# EAGLE design calculator5 (EAGLE 9.6.2)

## Sheet 1 of 2
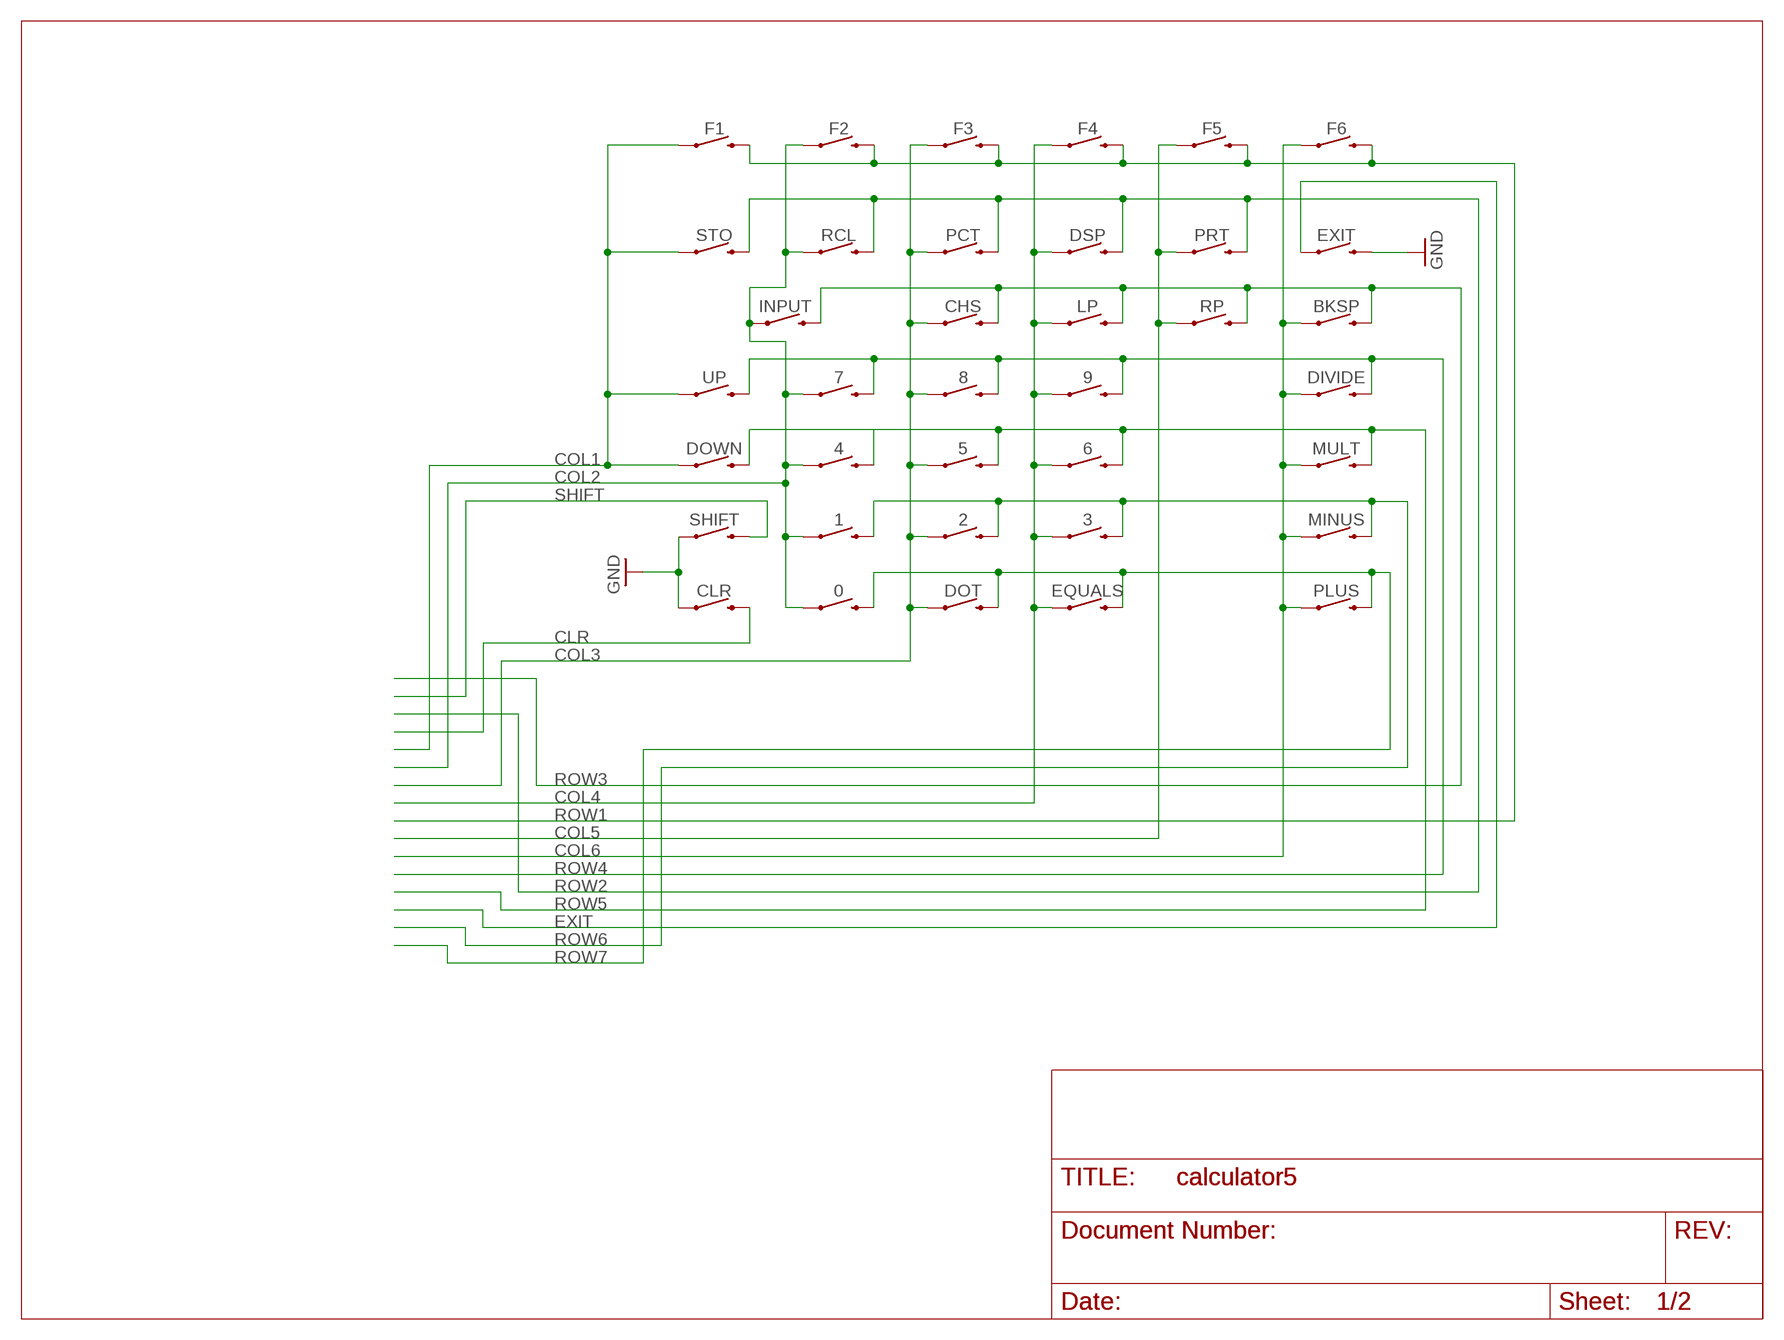
[diagram p0: schematic, sheet 1]

### Parts
0  BUTTON  [BUTTON]
1  BUTTON  [BUTTON]
2  BUTTON  [BUTTON]
3  BUTTON  [BUTTON]
4  BUTTON  [BUTTON]
5  BUTTON  [BUTTON]
6  BUTTON  [BUTTON]
7  BUTTON  [BUTTON]
8  BUTTON  [BUTTON]
9  BUTTON  [BUTTON]
BKSP  BUTTON  [BUTTON]
CHS  BUTTON  [BUTTON]
CLR  BUTTON  [BUTTON]
DIVIDE  BUTTON  [BUTTON]
DOT  BUTTON  [BUTTON]
DOWN  BUTTON  [BUTTON]
DSP  BUTTON  [BUTTON]
EQUALS  BUTTON  [BUTTON]
EXIT  BUTTON  [BUTTON]
F1  BUTTON  [BUTTON]
F2  BUTTON  [BUTTON]
F3  BUTTON  [BUTTON]
F4  BUTTON  [BUTTON]
F5  BUTTON  [BUTTON]
F6  BUTTON  [BUTTON]
INPUT  BUTTON  [BUTTON]
LP  BUTTON  [BUTTON]
MINUS  BUTTON  [BUTTON]
MULT  BUTTON  [BUTTON]
PCT  BUTTON  [BUTTON]
PLUS  BUTTON  [BUTTON]
PRT  BUTTON  [BUTTON]
RCL  BUTTON  [BUTTON]
RP  BUTTON  [BUTTON]
SHIFT  BUTTON  [BUTTON]
STO  BUTTON  [BUTTON]
UP  BUTTON  [BUTTON]

### Nets
CLR: CLR.3 ; also sheet 2
COL1: DOWN.1 F1.1 STO.1 UP.1 ; also sheet 2
COL2: 0.1 1.1 4.1 7.1 F2.1 INPUT.1 RCL.1 ; also sheet 2
COL3: 2.1 5.1 8.1 CHS.1 DOT.1 F3.1 PCT.1 ; also sheet 2
COL4: 3.1 6.1 9.1 DSP.1 EQUALS.1 F4.1 LP.1 ; also sheet 2
COL5: F5.1 PRT.1 RP.1 ; also sheet 2
COL6: BKSP.1 DIVIDE.1 F6.1 MINUS.1 MULT.1 PLUS.1 ; also sheet 2
EXIT: EXIT.1 ; also sheet 2
GND: CLR.1 EXIT.3 SHIFT.1 ; also sheet 2
ROW1: F1.3 F2.3 F3.3 F4.3 F5.3 F6.3 ; also sheet 2
ROW2: DSP.3 PCT.3 PRT.3 RCL.3 STO.3 ; also sheet 2
ROW3: BKSP.3 CHS.3 INPUT.3 LP.3 RP.3 ; also sheet 2
ROW4: 7.3 8.3 9.3 DIVIDE.3 UP.3 ; also sheet 2
ROW5: 4.3 5.3 6.3 DOWN.3 MULT.3 ; also sheet 2
ROW6: 1.3 2.3 3.3 MINUS.3 ; also sheet 2
ROW7: 0.3 DOT.3 EQUALS.3 PLUS.3 ; also sheet 2
SHIFT: SHIFT.3 ; also sheet 2

## Sheet 2 of 2
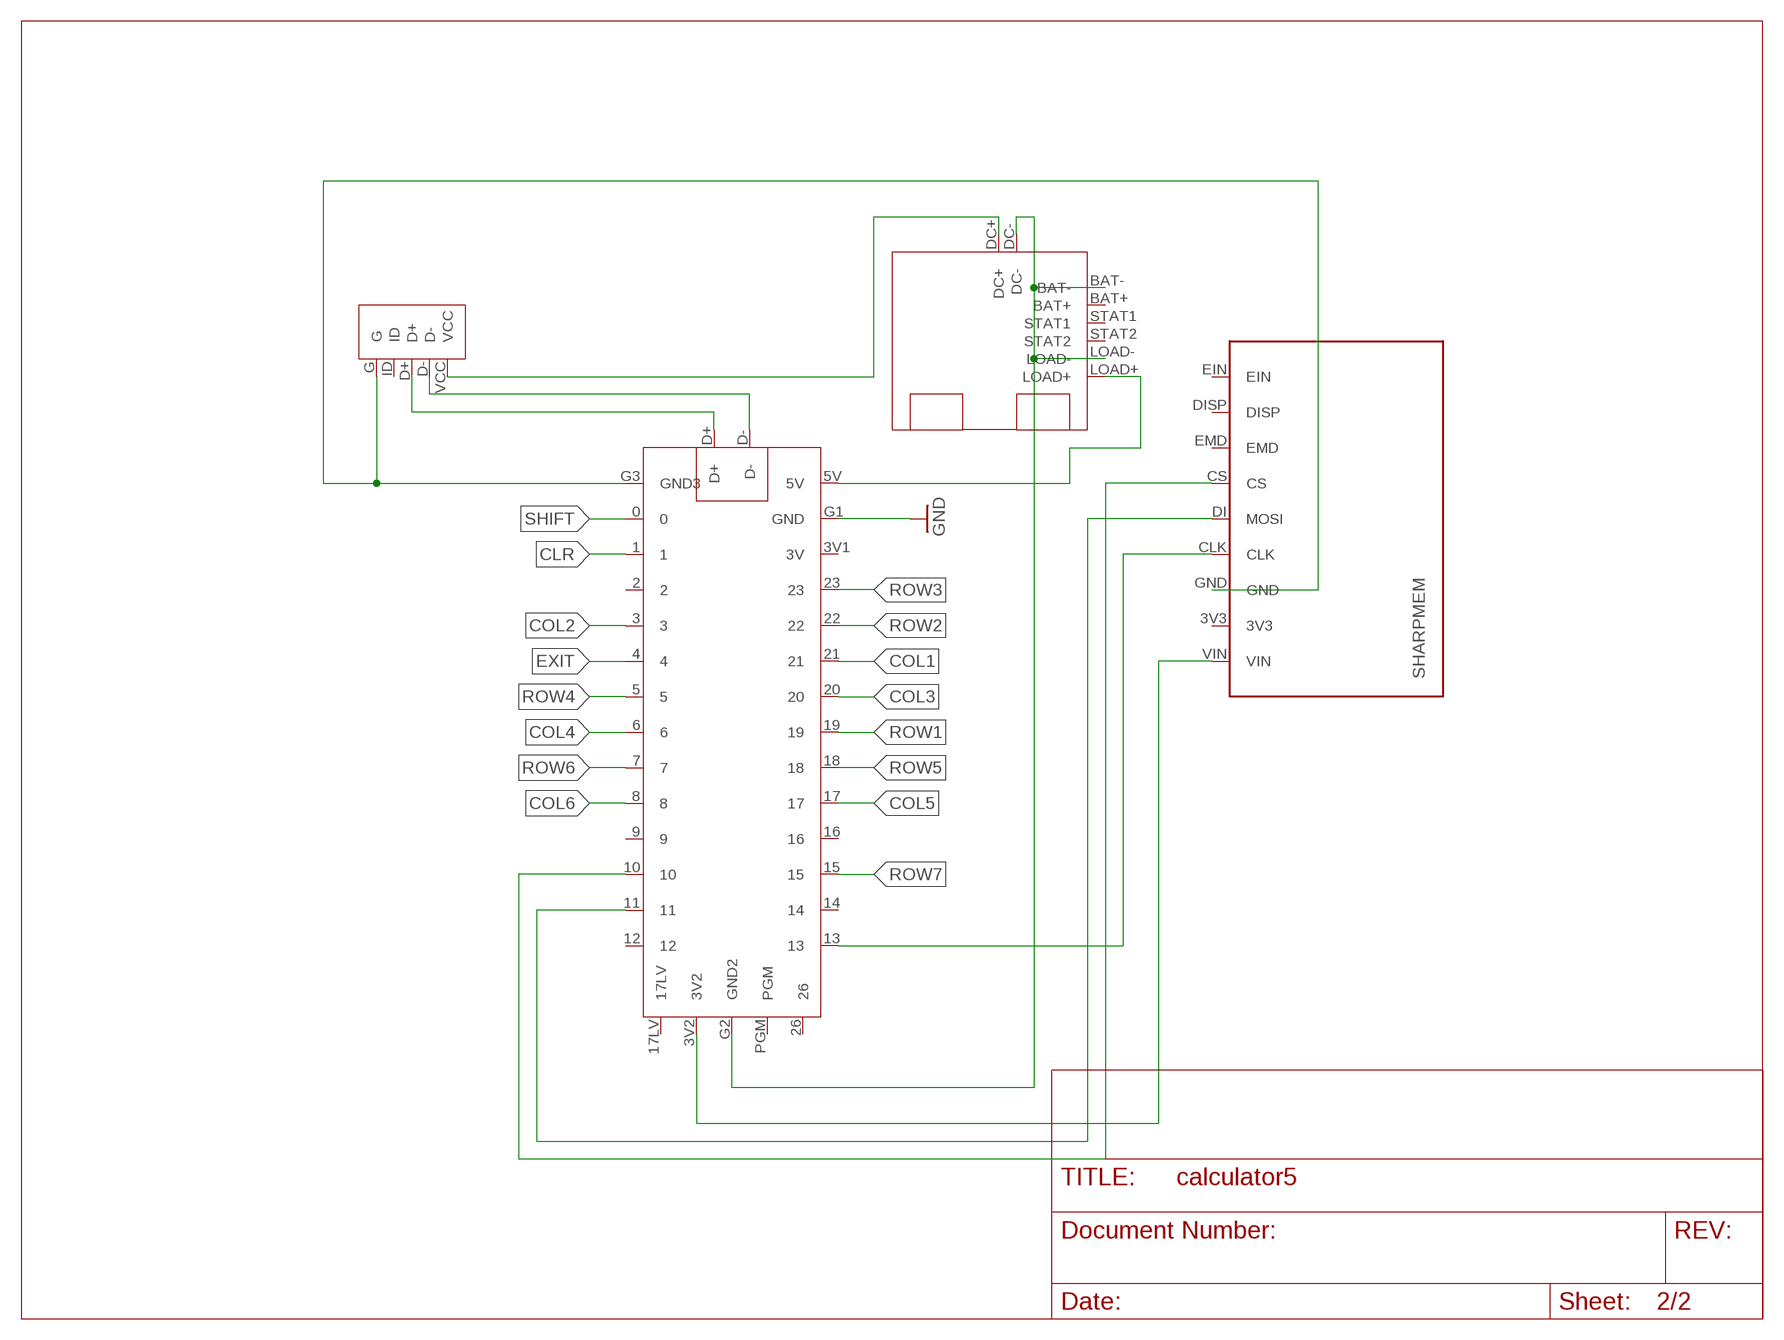
[diagram p1: schematic, sheet 2]

### Parts
SHARPMEM  SHARPMEM  [SHARPMEM]
U$1  TEENSY_LC  [TEENSY_LC]
U$2  USB  [USB]
U$3  LIPO_CHARGER  [LIPO_CHARGER]

### Nets
3V3: SHARPMEM.VIN U$1.3V2
CLR: U$1.1 ; also sheet 1
COL1: U$1.21 ; also sheet 1
COL2: U$1.3 ; also sheet 1
COL3: U$1.20 ; also sheet 1
COL4: U$1.6 ; also sheet 1
COL5: U$1.17 ; also sheet 1
COL6: U$1.8 ; also sheet 1
CS: SHARPMEM.CS U$1.10
D-: U$1.D- U$2.D-
EXIT: U$1.4 ; also sheet 1
G2: U$1.G2(GND2) U$3.BAT- U$3.DC- U$3.LOAD-
G3: SHARPMEM.GND U$1.G3(GND3) U$2.G
GND: U$1.G1(GND) ; also sheet 1
LOAD+: U$1.5V U$3.LOAD+
MOSI: SHARPMEM.DI(MOSI) U$1.11
N$6: U$1.D+ U$2.D+
ROW1: U$1.19 ; also sheet 1
ROW2: U$1.22 ; also sheet 1
ROW3: U$1.23 ; also sheet 1
ROW4: U$1.5 ; also sheet 1
ROW5: U$1.18 ; also sheet 1
ROW6: U$1.7 ; also sheet 1
ROW7: U$1.15 ; also sheet 1
SCK: SHARPMEM.CLK U$1.13
SHIFT: U$1.0 ; also sheet 1
VCC: U$2.VCC U$3.DC+
Unconnected: SHARPMEM.3V3 SHARPMEM.DISP SHARPMEM.EIN SHARPMEM.EMD U$1.2 U$1.3V1(3V) U$1.9 U$1.12 U$1.14 U$1.16 U$1.17LV U$1.26 U$1.PGM U$2.ID U$3.BAT+ U$3.STAT1 U$3.STAT2

## Library data of the parts
0 1-9 BKSP CHS CLR DIVIDE DOT DOWN DSP EQUALS EXIT F1-F6 INPUT LP MINUS MULT PCT PLUS PRT RCL RP SHIFT STO UP = aaa_pw:BUTTON
SHARPMEM = aaa_pw:SHARPMEM
U$1 = aaa_pw:TEENSY_LC
U$2 = aaa_pw:USB
U$3 = aaa_pw:LIPO_CHARGER

## Board
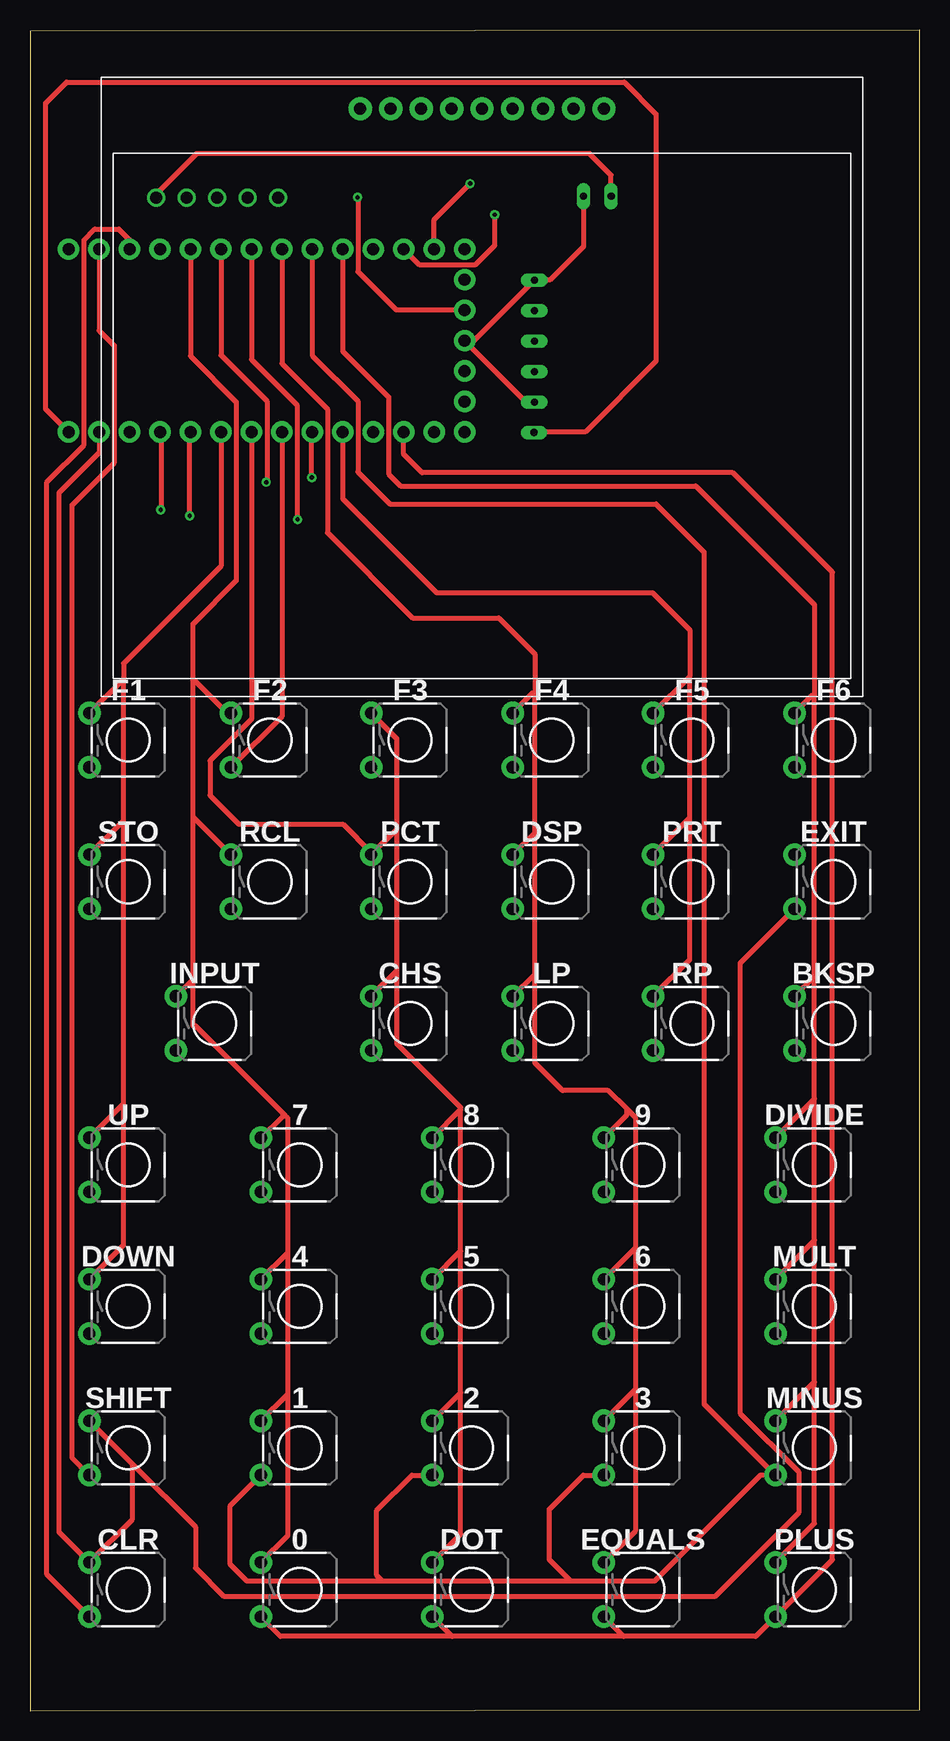
[diagram p2: board, top side]
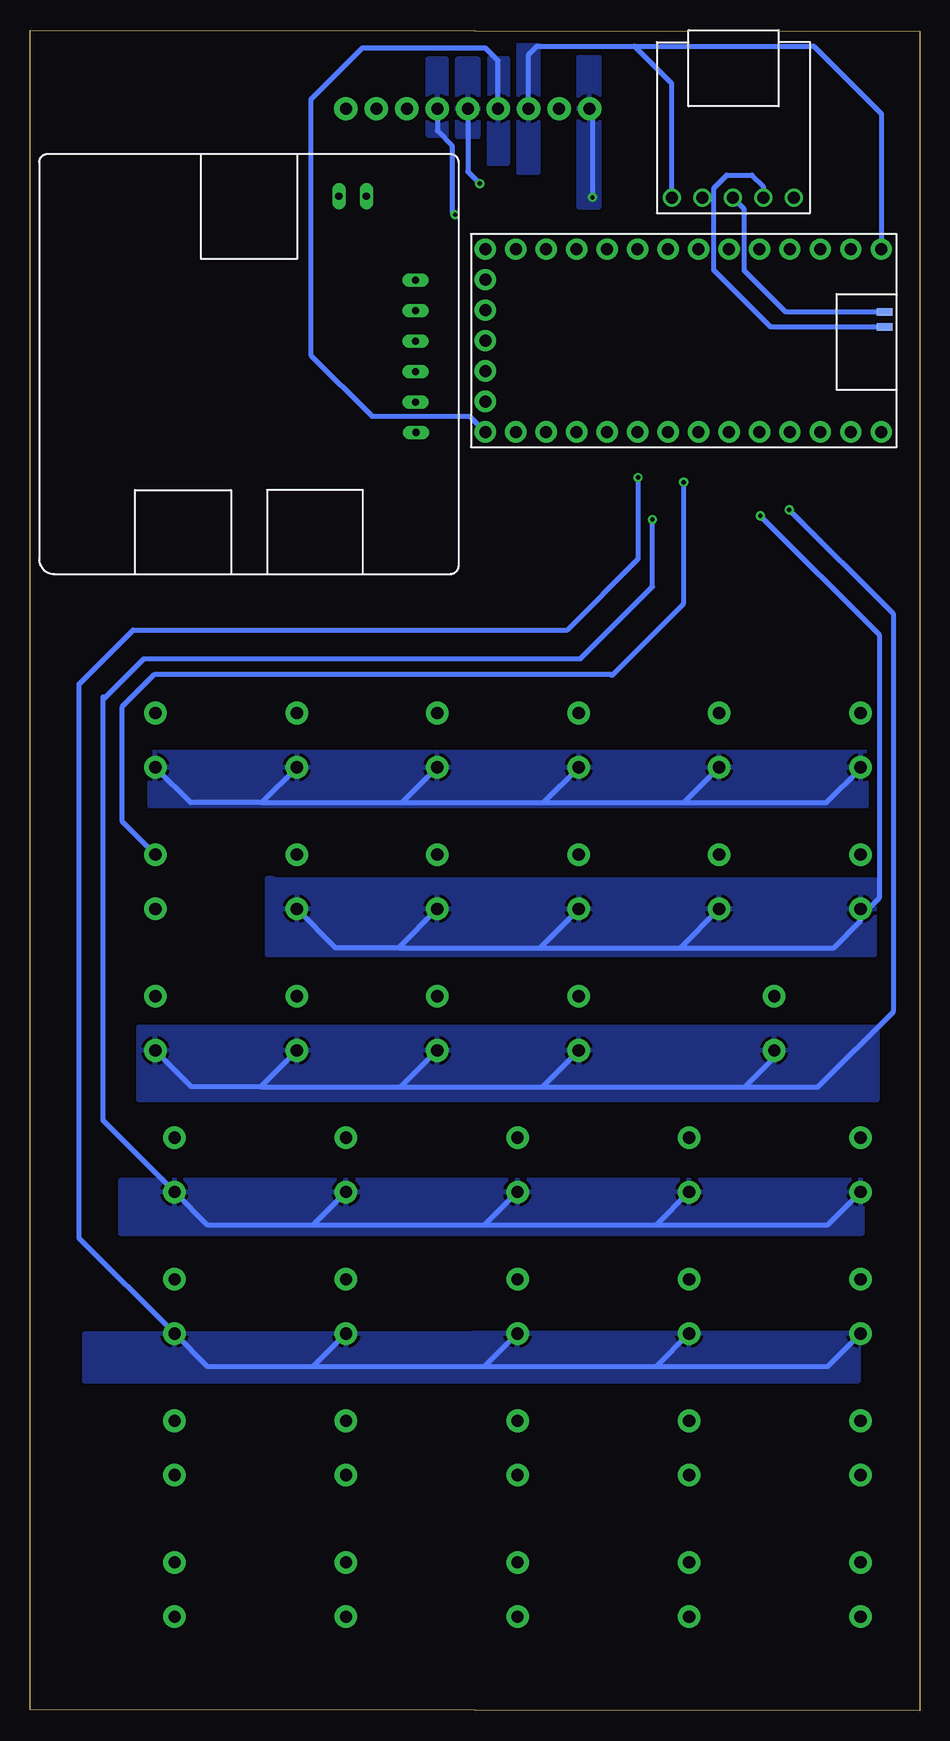
[diagram p3: board, bottom side, seen from below]

Size 74.2 x 140.1 mm. Coordinates in mm from the lower left corner, seen from the top.
Outline: 0,0 74.2,0.1 74.2,140.1 0,140 0,0
Copper layers (1*16): Top 0.035mm / dielectric 1.5mm / Bottom 0.035mm
Design rules "default": minimum track width 6mil, minimum drill 0.35mm, track to track 6mil, track to pad 6mil, pad to pad 6mil, via to via 6mil, smd to smd 6mil, copper to edge 40mil, drill to drill 6mil, minimum pad ring 10mil, minimum via ring 8mil, stop-mask expansion 4mil, vias tented up to drill 0mil, thermal gap 10mil

### Footprints (pad centres in the part's own frame; a part is rotated, then mirrored left to right if it is on the bottom)
BUTTON = drill 1.016 pad 1.88: 1 -3.251,2.261; 3 -3.251,-2.261
SHARPMEM = drill 1 pad 1.93: 3V3 -7.62,23.2; CLK -2.54,23.2; CS 2.54,23.2; DI 0,23.2; DISP 7.62,23.2; EIN 10.16,23.2; EMD 5.08,23.2; GND -5.08,23.2; VIN -10.16,23.2
TEENSY_LC = drill 1 pad 1.778: 0 3.81,1.27; 1 6.35,1.27; 2 8.89,1.27; 3 11.43,1.27; 3V1 6.35,16.51; 3V2 34.29,6.35; 4 13.97,1.27; 5 16.51,1.27; 5V 1.27,16.51; 6 19.05,1.27; 7 21.59,1.27; 8 24.13,1.27; 9 26.67,1.27; 10 29.21,1.27; 11 31.75,1.27; 12 34.29,1.27; 13 34.29,16.51; 14 31.75,16.51; 15 29.21,16.51; 16 26.67,16.51; 17 24.13,16.51; 17LV 34.29,3.81; 18 21.59,16.51; 19 19.05,16.51; 20 16.51,16.51; 21 13.97,16.51; 22 11.43,16.51; 23 8.89,16.51; 26 34.29,13.97; G1 3.81,16.51; G2 34.29,8.89; G3 1.27,1.27; PGM 34.29,11.43 | smd 1.27 x 0.635: D+ 1,6.5; D- 1,7.75
USB = drill 1: D+ 6.35,1.27; D- 8.89,1.27; G 1.27,1.27; ID 3.81,1.27; VCC 11.43,1.27
LIPO_CHARGER = drill 0.6 long: BAT+ 31.4,21.96; BAT- 31.4,24.5; DC+ 25,31.5; DC- 27.3,31.5; LOAD+ 31.43,11.8; LOAD- 31.4,14.34; STAT1 31.4,19.42; STAT2 31.4,16.88

### Placement (x,y rotation side)
0  22.5,10.1 0 top
1  22.5,21.9 0 top
2  36.8,21.9 0 top
3  51.1,21.9 0 top
4  22.5,33.7 0 top
5  36.8,33.7 0 top
6  51.1,33.7 0 top
7  22.5,45.5 0 top
8  36.8,45.5 0 top
9  51.1,45.5 0 top
BKSP  67,57.3 0 top
CHS  31.7,57.3 0 top
CLR  8.2,10.1 0 top
DIVIDE  65.4,45.5 0 top
DOT  36.8,10.1 0 top
DOWN  8.2,33.7 0 top
DSP  43.5,69.1 0 top
EQUALS  51.1,10.1 0 top
EXIT  67,69.1 0 top
F1  8.2,80.9 0 top
F2  20,80.9 0 top
F3  31.7,80.9 0 top
F4  43.5,80.9 0 top
F5  55.2,80.9 0 top
F6  67,80.9 0 top
INPUT  15.4,57.3 0 top
LP  43.5,57.3 0 top
MINUS  65.4,21.9 0 top
MULT  65.4,33.7 0 top
PCT  31.7,69.1 0 top
PLUS  65.4,10.1 0 top
PRT  55.2,69.1 0 top
RCL  20,69.1 0 top
RP  55.2,57.3 0 top
SHARPMEM  37.7,110.35 0 top
SHIFT  8.2,21.9 0 top
STO  8.2,69.1 0 top
U$1  1.95,123.1 180 bottom
U$2  21.95,124.85 0 bottom
U$3  73.45,94.75 0 bottom
UP  8.2,45.5 0 top

### Tracks (layer width: path | path; a pad name or v marks a point on that pad's centre or on a via)
3V3  (via drill 0.35)
  Top 0.406: U$1.3V2 30.55,116.75 27.35,119.95 27.35,126.1 v27.3,126.15
  Bottom 0.406: SHARPMEM.VIN 27.3,133.31 v27.3,126.15
  pour Bottom: 28.45,133.7 28.45,137.85 27.5,137.85 26.75,137.85 26.75,133.3 26.75,125.35 28.25,125.35 28.45,125.35 28.45,133.55
CLR
  Top 0.406: CLR.3 1.4,11.39 1.4,102.4 4.5,105.5 4.5,122.6 5.4,123.5 7.4,123.5 8.3,122.6 U$1.1
COL1
  Top 0.406: DOWN.1 7.8,38.81 7.8,50.61 | 7.8,50.61 7.8,74.21 | 7.8,74.21 7.8,86.01 | 7.8,86.01 7.8,87.3 15.92,95.42 U$1.21 | UP.1 7.8,50.61 | STO.1 7.8,74.21 | F1.1 7.8,86.01
COL2
  Top 0.406: U$1.3 13.38,112.92 17.2,109.1 17.2,94.2 13.6,90.6 13.6,86 | 0.1 21.5,14.61 21.5,26.41 | 21.5,26.41 21.5,38.21 | 21.5,38.21 21.5,49.4 21.3,49.6 | 21.3,49.6 13.8,57.1 13.6,57.1 13.6,61.01 | 13.6,61.01 13.6,74.51 | 13.6,74.51 13.6,86 | 1.1 21.5,26.41 | 4.1 21.5,38.21 | 7.1 21.09,49.6 21.3,49.6 | INPUT.1 13.6,61.01 | RCL.1 13.6,74.51 | F2.1 16.44,83.16 13.6,86
COL3
  Top 0.406: DOT.1 35.9,14.71 35.9,26.51 | 30.6,61.71 30.6,55.6 35.9,50.3 35.9,50.11 | 30.6,61.71 30.6,73.5 | 30.6,73.5 30.6,81.01 F3.1 | 35.9,26.51 35.9,38.31 | 35.9,38.31 35.9,50.11 | 2.1 35.9,26.51 | 5.1 35.9,38.31 | 8.1 35.9,50.11 | CHS.1 30.6,61.71 | 30.6,73.5 30.59,73.5 PCT.1 28.45,71.55 26.1,73.9 17.4,73.9 15,76.3 15,79.2 18.46,82.66 U$1.20
COL4
  Top 0.406: EQUALS.1 50.5,15.01 50.5,26.81 | 50.5,26.81 50.5,38.61 | 50.5,38.61 50.5,49.4 49.75,50.15 | 49.75,50.15 48.2,51.7 44.4,51.7 42.1,54 42.1,61.41 | 42.1,61.41 42.1,73.21 | 42.1,73.21 42.1,84.9 | 42.1,84.9 42.1,88.1 39.1,91.1 31.9,91.1 24.8,98.2 24.8,108.5 21,112.3 U$1.6 | 3.1 50.5,26.81 | 6.1 50.5,38.61 | 9.1 49.75,49.66 49.75,50.15 | LP.1 42.1,61.41 | DSP.1 42.1,73.21 | F4.1 41.99,84.9 42.1,84.9
COL5
  Top 0.406: RP.1 55,62.61 55,74.4 | 55,74.4 55,86.21 | PRT.1 54.99,74.4 55,74.4 | F5.1 55,86.21 | 55,86.21 55,90.1 51.9,93.2 33.9,93.2 26.08,101.02 U$1.17
COL6
  Top 0.406: PLUS.1 65.4,15.61 65.4,27.41 | 65.4,27.41 65.4,39.21 | 65.4,39.21 65.4,51.01 | 65.4,51.01 65.4,61.21 | 65.4,61.21 65.4,84.7 | MINUS.1 65.4,27.41 | MULT.1 65.4,39.21 | DIVIDE.1 65.4,51.01 | BKSP.1 65.4,61.21 | F6.1 65.29,84.7 65.4,84.7 | U$1.8 26.08,113.32 29.9,109.5 29.9,103.1 30.9,102.1 55.5,102.1 65.4,92.2 65.4,84.7
CS  (via drill 0.35)
  Top 0.406: U$1.10 32.44,120.55 37.15,120.55 38.75,122.15 v38.75,124.7
  Bottom 0.406: SHARPMEM.CS 40.24,131.69 39,130.45 39,124.95 v38.75,124.7
  pour Bottom: 41,133.5 41,137.7 40.2,137.7 39.5,137.7 39.5,133.3 39.5,131.3 40.45,131.3 41,131.3
D-
  Bottom 0.406: U$1.D- 12.45,115.35 17.2,120.1 17.2,126.9 16.1,128 14,128 13.06,127.06 U$2.D-
EXIT  (via drill 0.35)
  Top 0.406: U$1.4 15.92,112.98 19.75,109.15 19.75,102.45 v19.7,102.4
  Bottom 0.406: EXIT.1 66.5,74.11 66.5,83.7 63.8,86.4 25.8,86.4 25.7,86.3 19.7,92.3 v19.7,102.4
G2
  Top 0.406: U$3.DC- 46.15,122.05 43.35,119.25 U$3.BAT- 37.01,114.21 U$1.G2 41.36,109.09 U$3.LOAD-
G3
  Bottom 0.406: SHARPMEM.GND 32.62,138.05 31.92,138.75 23.8,138.75 | 23.8,138.75 8.85,138.75 3.22,133.12 U$1.G3 | U$2.G 20.68,135.63 23.8,138.75
  pour Bottom: 33.45,133.55 33.45,142.35 32.3,142.35 31.85,142.35 31.85,133.45 31.85,128.2 32.6,128.2 33.45,128.2 33.45,133.45
GND
  Top 0.406: EXIT.3 59.2,62.29 59.2,24.8 64.1,19.9 64.1,16.5 57.15,9.55 | 57.15,9.55 57.1,9.5 | 57.15,9.55 16.15,9.55 13.8,11.9 13.8,15.31 8.55,20.55 | SHIFT.1 8.55,20.55 | 8.55,20.55 8.55,15.97 CLR.1 2.4,14.91 2.4,101.5 5.76,104.86 U$1.G1
LOAD+
  Top 0.406: U$1.5V 1.3,108.51 1.3,134 3.05,135.75 49.55,135.75 52.2,133.1 52.2,112.5 46.3,106.6 42.07,106.6 U$3.LOAD+
MOSI  (via drill 0.35)
  Top 0.406: U$1.11 33.7,124.3 v36.7,127.3
  Bottom 0.406: v36.7,127.3 37.7,128.3 SHARPMEM.DI
  pour Bottom: 38.55,133.55 38.55,137.7 37.7,137.7 36.85,137.7 36.85,133.5 36.85,131.2 37.75,131.2 38.55,131.2 38.55,133.45
N$6
  Bottom 0.406: U$1.D+ 11.2,116.6 14.65,120.05 14.65,125.17 U$2.D+
ROW1
  Top 0.406: U$1.19 21,82.89 F2.3
  Bottom 0.406: F6.3 60.81,75.7 54.89,75.7 | 54.89,75.7 43.19,75.7 | 43.19,75.7 31.39,75.7 | 31.39,75.7 19.69,75.7 | 19.69,75.7 7.8,75.7 4.95,78.55 F1.3 | F2.3 19.69,75.7 | F3.3 31.39,75.7 | F4.3 43.19,75.7 | F5.3 54.89,75.7
  pour Bottom: 63.9,79.9 4.5,79.9 4.5,76.6 4.5,75.4 64.2,75.4 64.2,79.8 63.9,79.8
ROW2  (via drill 0.35)
  Top 0.406: U$1.22 13.28,106.49 13.28,99.62 v13.3,99.6
  Bottom 0.406: PRT.3 48.71,63.6 43.49,63.6 | 43.49,63.6 31.69,63.6 | 31.69,63.6 19.99,63.6 | 19.99,63.6 7.2,63.6 4.95,65.85 4.95,66.2 | 4.95,66.2 STO.3 | RCL.3 19.99,63.6 | PCT.3 31.69,63.6 | DSP.3 43.49,63.6 | 13.18,99.58 13.2,99.6 v13.3,99.6 3.4,89.7 3.4,67.75 4.95,66.2
  pour Bottom: 53.8,69.3 3.8,69.3 3.8,63 54.4,63 54.4,64 54.4,69.4 54,69.4
ROW3  (via drill 0.35)
  Top 0.406: U$1.23 10.94,106.49 10.94,100.14 v10.9,100.1
  Bottom 0.406: BKSP.3 60.71,52 54.99,52 | 54.99,52 43.29,52 | 43.29,52 31.49,52 | 31.49,52 14.6,52 | 14.6,52 12.15,54.45 INPUT.3 | CHS.3 31.49,52 | LP.3 43.29,52 | RP.3 54.99,52 | 14.6,52 8.5,52 2.2,58.3 2.2,91.4 v10.9,100.1
  pour Bottom: 64.8,57 3.6,57 3.6,52.1 3.6,50.9 64.8,50.9 65.1,50.9 65.1,57
ROW4  (via drill 0.35)
  Top 0.406: U$1.5 18.46,112.64 22.25,108.85 22.25,99.35 v22.3,99.3
  Bottom 0.406: UP.3 7.69,40.5 21.99,40.5 | 50.59,40.5 59.41,40.5 DIVIDE.3 68.1,49.19 68.1,84.3 | 50.59,40.5 36.29,40.5 | 36.29,40.5 21.99,40.5 | 7.3 21.99,40.5 | 8.3 36.29,40.5 | 9.3 50.59,40.5 | 68.1,84.3 68.1,84.5 | 68.1,84.3 64.7,87.7 28.3,87.7 22.3,93.7 v22.3,99.3
  pour Bottom: 4.8,44.2 66.7,44.2 66.7,39.8 5.2,39.8 4.8,39.8
ROW5  (via drill 0.35)
  Top 0.406: U$1.18 23.44,106.49 23.44,102.86 v23.5,102.8
  Bottom 0.406: DOWN.3 7.69,28.7 21.99,28.7 | 50.59,28.7 59.41,28.7 MULT.3 70.1,39.39 70.1,85.6 65.6,90.1 29.4,90.1 23.5,96 v23.5,102.8 23.5,102.9 | 50.59,28.7 36.29,28.7 | 36.29,28.7 21.99,28.7 | 6.3 50.59,28.7 | 5.3 36.29,28.7 | 4.3 21.99,28.7
  pour Bottom: 69.7,31.4 69.7,27.5 5.1,27.5 5.1,31.5
ROW6
  Top 0.406: 1.3 16.7,17.09 16.7,12.2 18.1,10.8 29.4,10.8 | 45.1,10.8 52.07,10.8 60.9,19.64 MINUS.3 56.2,25.59 56.2,96.6 52.2,100.6 30,100.6 27.35,103.25 27.35,109.15 23.54,112.96 U$1.7 | 45.1,10.8 29.4,10.8 | 29.4,10.8 28.9,11.3 28.9,16.7 31.84,19.64 2.3 | 45.1,10.8 43.3,12.6 43.3,16.8 46.14,19.64 3.3
ROW7
  Top 0.406: U$1.15 31.16,104.74 32.7,103.2 58.6,103.2 66.9,94.9 66.9,12.59 PLUS.3 60.51,6.2 49.49,6.2 | 49.49,6.2 35.19,6.2 | 35.19,6.2 20.89,6.2 0.3 | DOT.3 35.19,6.2 | EQUALS.3 49.49,6.2
SCK
  Bottom 0.406: SHARPMEM.CLK 35.16,137.55 36.21,138.6 46.5,138.6 50.8,134.3 50.8,113 45.7,107.9 37.55,107.9 U$1.13
  pour Bottom: 35.85,133.55 35.85,137.75 35.1,137.75 34.4,137.75 34.4,128.95 35.9,128.95 35.9,133.5
SHIFT
  Top 0.406: U$1.0 5.76,115.04 7.05,113.75 7.05,104.05 3.5,100.5 3.5,21.09 SHIFT.3
VCC
  Top 0.406: U$3.DC+ 48.45,128 46.65,129.8 13.9,129.8 10.52,126.42 U$2.VCC